# Altium schematic sheet 1_P1.schdoc
size 314 x 314 mm; Symbol: Drawing-Symbol_A4; Device: Drawing-Symbol_A4; @Project Name: AudioDeck; @Page Count: 1; @Update Date: 2026-05-18; @Create Date: 2026-05-18; @Schematic Name: Schematic 1.3; @Page No: 1; @Page Name: P1; Company: EasyEDA.com; Version: V1.0; Page Size: A4; @Create Time: 18:39:17; @Update Time: 13:41:27; Width: 1200; Height: 1200; Region Start: 1; X Region Count: 6; Y Region Count: 4; Blade Width: 10; Title Block Position: 3; @Board Name: Prototype 1.3
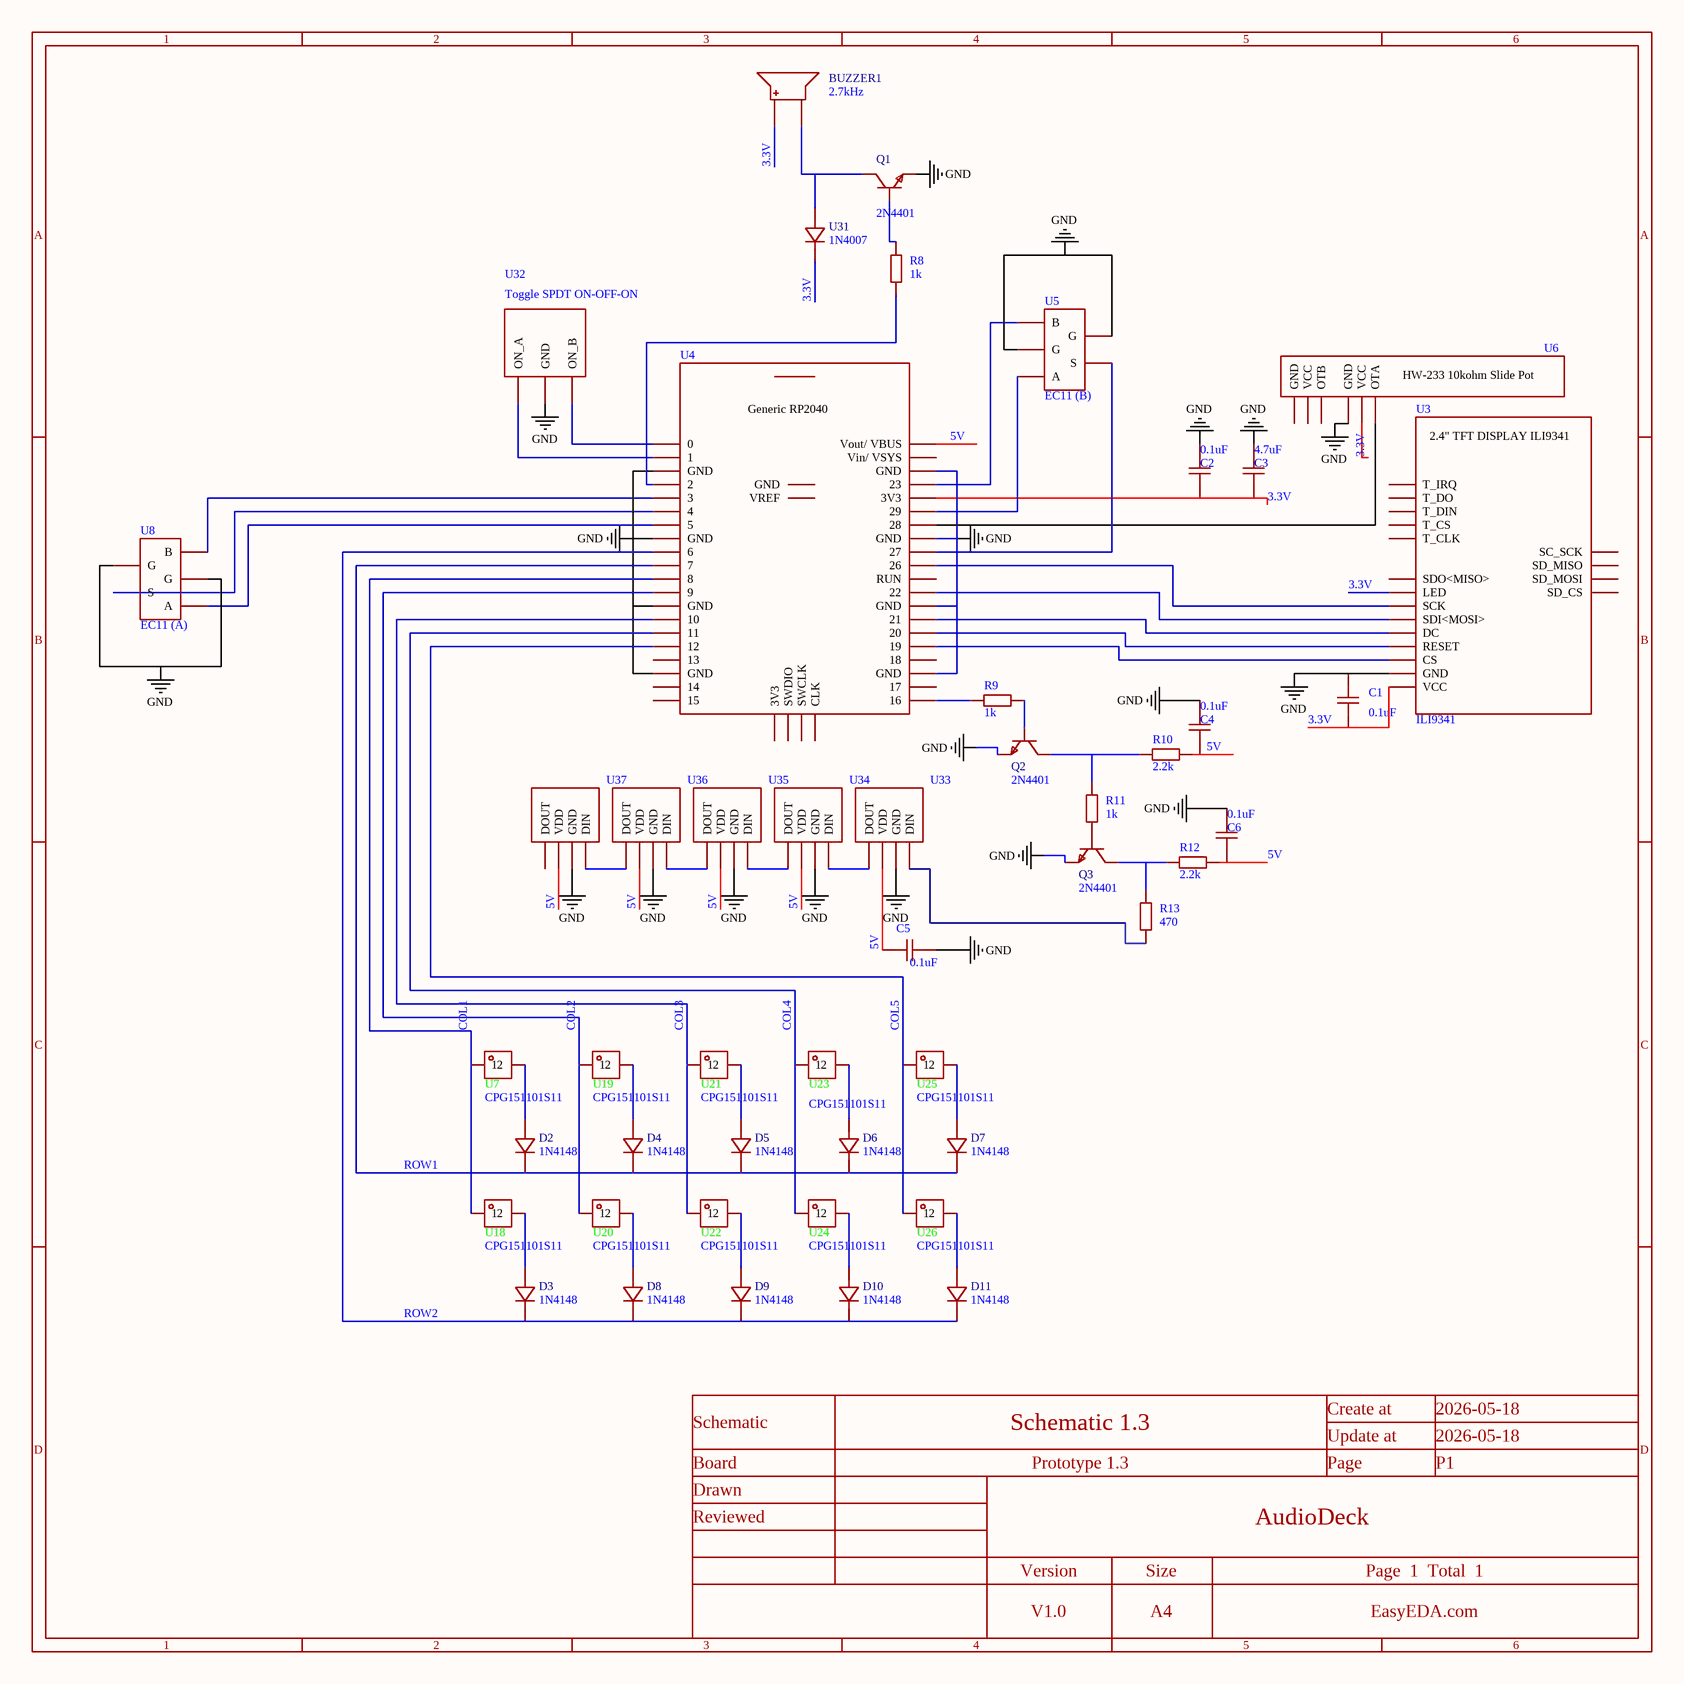
[diagram p0: 1_P1.schdoc]

## Parts
BUZZER1  2.7kHz  [BUZ-TH_BD9.0-P4.00-D0.6-FD]
C1  0.1uF  [C0603]
C2  0.1uF  [C0603]
C3  4.7uF  [C0603]
C4  0.1uF  [C0603]
C5  0.1uF  [C0603]
C6  0.1uF  [C0603]
D2  1N4148  [DO-35_BD1.7-L3.6-P10.00-D0.5-RD]
D3  1N4148  [DO-35_BD1.7-L3.6-P10.00-D0.5-RD]
D4  1N4148  [DO-35_BD1.7-L3.6-P10.00-D0.5-RD]
D5  1N4148  [DO-35_BD1.7-L3.6-P10.00-D0.5-RD]
D6  1N4148  [DO-35_BD1.7-L3.6-P10.00-D0.5-RD]
D7  1N4148  [DO-35_BD1.7-L3.6-P10.00-D0.5-RD]
D8  1N4148  [DO-35_BD1.7-L3.6-P10.00-D0.5-RD]
D9  1N4148  [DO-35_BD1.7-L3.6-P10.00-D0.5-RD]
D10  1N4148  [DO-35_BD1.7-L3.6-P10.00-D0.5-RD]
D11  1N4148  [DO-35_BD1.7-L3.6-P10.00-D0.5-RD]
Q1  2N4401  [TO-92-3_L4.9-W3.7-P1.27-L]
Q2  2N4401  [TO-92-3_L4.9-W3.7-P1.27-L]
Q3  2N4401  [TO-92-3_L4.9-W3.7-P1.27-L]
R8  1k  [R0603]
R9  1k  [R0603]
R10  2.2k  [R0603]
R11  1k  [R0603]
R12  2.2k  [R0603]
R13  470  [R0603]
U3  ILI9341
U4  (no value)
U5  EC11 (B)
U6  (no value)
U7  CPG151101S11  [TH_L11.0-W5.9-KS-2P02B01-01]
U8  EC11 (A)
U18  CPG151101S11  [TH_L11.0-W5.9-KS-2P02B01-01]
U19  CPG151101S11  [TH_L11.0-W5.9-KS-2P02B01-01]
U20  CPG151101S11  [TH_L11.0-W5.9-KS-2P02B01-01]
U21  CPG151101S11  [TH_L11.0-W5.9-KS-2P02B01-01]
U22  CPG151101S11  [TH_L11.0-W5.9-KS-2P02B01-01]
U23  CPG151101S11  [TH_L11.0-W5.9-KS-2P02B01-01]
U24  CPG151101S11  [TH_L11.0-W5.9-KS-2P02B01-01]
U25  CPG151101S11  [TH_L11.0-W5.9-KS-2P02B01-01]
U26  CPG151101S11  [TH_L11.0-W5.9-KS-2P02B01-01]
U31  1N4007  [DO-41_BD2.4-L4.7-P8.70-D0.6-RD]
U32  Toggle SPDT ON-OFF-ON
U33  (no value)
U34  (no value)
U35  (no value)
U36  (no value)
U37  (no value)

## Nets
GND: C1.1 C2.1 C3.1 C4.1 C5.2 C6.1 Q1.1(E) Q2.1(E) Q3.1(E) U3.2(GND) U4.3(GND) U4.8(GND) U4.13(GND) U4.18(GND) U4.23(GND) U4.28(GND) U4.33(GND) U4.38(GND) U5.1(G) U5.4(G) U6.4(GND) U8.1(G) U8.4(G) U32.2(GND) U33.3(GND) U34.3(GND) U35.3(GND) U36.3(GND) U37.3(GND)
3.3V: BUZZER1.1 C1.2 C2.2 C3.2 U3.1(VCC) U3.8(LED) U4.25(3V3) U6.5(VCC) U31.1(C)
5V: C4.2 C5.1 C6.2 R10.1 R12.1 U4.21(Vout/_VBUS) U33.2(VDD) U34.2(VDD) U35.2(VDD) U36.2(VDD) U37.2(VDD)
COL1: U4.11(8) U7.1 U18.1
COL2: U4.12(9) U19.1 U20.1
COL3: U4.14(10) U21.1 U22.1
COL4: U4.15(11) U23.1 U24.1
COL5: U4.16(12) U25.1 U26.1
ROW1: D2.1(C) D4.1(C) D5.1(C) D6.1(C) D7.1(C) U4.10(7)
ROW2: D3.1(C) D8.1(C) D9.1(C) D10.1(C) D11.1(C) U4.9(6)
NetBUZZER1_2: BUZZER1.2 Q1.3(C) U31.2(A)
NetD2_2: D2.2(A) U7.2
NetD3_2: D3.2(A) U18.2
NetD4_2: D4.2(A) U19.2
NetD5_2: D5.2(A) U21.2
NetD6_2: D6.2(A) U23.2
NetD7_2: D7.2(A) U25.2
NetD8_2: D8.2(A) U20.2
NetD9_2: D9.2(A) U22.2
NetD10_2: D10.2(A) U24.2
NetD11_2: D11.2(A) U26.2
NetQ1_2: Q1.2(B) R8.2
NetQ2_2: Q2.2(B) R9.1
NetQ2_3: Q2.3(C) R10.2 R11.1
NetQ3_2: Q3.2(B) R11.2
NetQ3_3: Q3.3(C) R12.2 R13.1
NetR8_1: R8.1 U4.4(2)
NetR9_2: R9.2 U4.40(16)
NetR13_2: R13.2 U33.4(DIN)
NetU3_3: U3.3(CS) U4.36(19)
NetU3_4: U3.4(RESET) U4.35(20)
NetU3_5: U3.5(DC) U4.34(21)
NetU3_6: U3.6(SDI<MOSI>) U4.32(22)
NetU3_7: U3.7(SCK) U4.30(26)
NetU4_1: U4.1(0) U32.3(ON_B)
NetU4_2: U4.2(1) U32.1(ON_A)
NetU4_5: U4.5(3) U8.5(B)
NetU4_6: U4.6(4) U8.2(S)
NetU4_7: U4.7(5) U8.3(A)
NetU4_24: U4.24(23) U5.5(B)
NetU4_26: U4.26(29) U5.3(A)
NetU4_27: U4.27(28) U6.6(OTA)
NetU4_29: U4.29(27) U5.2(S)
NetU33_1: U33.1(DOUT) U34.4(DIN)
NetU34_1: U34.1(DOUT) U35.4(DIN)
NetU35_1: U35.1(DOUT) U36.4(DIN)
NetU36_1: U36.1(DOUT) U37.4(DIN)

Not connected (* = marked no-connect by the designer): U3 9(SDO<MISO>) 10(T_CLK) 11(T_CS) 12(T_DIN) 13(T_DO) 14(T_IRQ) 15(SD_CS) 16(SD_MOSI) 17(SD_MISO) 18(SC_SCK); U4 17(13) 19(14) 20(15) 22(Vin/_VSYS) 31(RUN) 37(18) 39(17) 41(GND) 42(VREF) 43(3V3) 44(SWDIO) 45(SWCLK) 46(CLK); U6 1(GND) 2(VCC) 3(OTB); U37 1(DOUT)

## Notes on the sheet
- 1
- 2
- 3
- 4
- 5
- 6
- A
- B
- C
- Schematic
- Schematic 1.3
- Create at
- Update at
- 2026-05-18
- D
- Board
- Drawn
- Prototype 1.3
- Page
- P1
- Reviewed
- Version
- Size
- AudioDeck
- Page  1  Total  1
- V1.0
- A4
- EasyEDA.com
- (in symbol HW-233 10k Slide Pot) HW-233 10kohm Slide Pot
- (in symbol ILI9341) 2.4" TFT DISPLAY ILI9341
- (in symbol RP2040-GENERIC-ALEXP) Generic RP2040

## Library data of the parts
BUZZER1 = QMB-09B-03: Manufacturer: 华能; Add into BOM: yes; Driver Circuitry: Passive (Externally Driven); Voltage - Supply: 2V~5V; Sound Pressure Level(SPL): 85dB; Symbol: QMB-09B-03; Device: QMB-09B-03; LCSC Part Name: 无源蜂鸣器QMB-09B-03; Supplier Part: C96256; Manufacturer Part: QMB-09B-03; Supplier Footprint: 插件,D=9mm; JLCPCB Part Class: Extended Part; Datasheet: https://item.szlcsc.com/datasheet/QMB-09B-03/97460.html; Supplier: LCSC; Convert to PCB: yes; Technology: Electromagnetic; Value: 2.7kHz; Diameter(φD): 9mm; Height: 5.7mm
C1-C6 = CAP_0603: Symbol: CAP; Convert to PCB: yes; Device: CAP_0603; Add into BOM: yes; Supplier Footprint: 0603
  C1 C2 C4-C6: Value: 0.1uF
  C3: Value: 4.7uF
D2-D11 = 1N4148_C22434654: Manufacturer: DIOTEC(德欧泰克); Add into BOM: yes; Pd - Power Dissipation: 500mW; Current - Rectified: 200mA; Voltage - DC Reverse(Vr): 75V; Voltage - Forward(Vf@If): 1V@10mA; Reverse Leakage Current (Ir): 5uA@75V; Operating Junction Temperature Range: -50℃~+175℃; Symbol: 1N4148_C22434654; Device: 1N4148_C22434654; LCSC Part Name: 1N4148; Supplier Part: C22434654; Manufacturer Part: 1N4148; Supplier Footprint: DO-35; JLCPCB Part Class: Extended Part; Datasheet: https://item.szlcsc.com/datasheet/1N4148/24058303.html; Supplier: LCSC; Convert to PCB: yes; Diode Configuration: -; Non-Repetitive Peak Forward Surge Current: -; Reverse Recovery Time (trr): -
Q1-Q3 = 2N4401: Manufacturer: ST(先科); Add into BOM: yes; type: NPN; Collector - Emitter Voltage VCEO: 40V; Pd - Power Dissipation: 625mW; DC Current Gain: 100@150mA,1V; Transition frequency(fT): 250MHz; Current - Collector Cutoff: 100nA; Vce Saturation(VCE(sat)): 750mV; Symbol: 2N4401; Device: 2N4401; LCSC Part Name: hfe=40~300; Supplier Part: C118540; Manufacturer Part: 2N4401; Supplier Footprint: TO-92-3; JLCPCB Part Class: Extended Part; Datasheet: https://atta.szlcsc.com/upload/public/pdf/source/20170719/C118540_1500457735787828248.pdf; Supplier: LCSC; Convert to PCB: yes; Operating Temperature: -
R8-R13 = Res_0603: Symbol: Res; Convert to PCB: yes; Device: Res_0603; Add into BOM: yes; Supplier Footprint: 0603
  R8 R9 R11: Value: 1k
  R10 R12: Value: 2.2k
  R13: Value: 470
U3 = ILI9341: Add into BOM: yes; Symbol: ILI9341; Device: ILI9341; Convert to PCB: yes
U4 = RP2040-GENERIC-ALEXP: Add into BOM: yes; Symbol: RP2040-GENERIC-ALEXP; Device: RP2040-GENERIC-ALEXP; Convert to PCB: yes
U5 U8 = Generic EC11 encoder: Add into BOM: yes; Symbol: Generic EC11 encoder; Device: Generic EC11 encoder; Convert to PCB: yes
U6 = HW-233 10k Slide Pot: Add into BOM: yes; Symbol: HW-233 10k Slide Pot; Device: HW-233 10k Slide Pot; Convert to PCB: yes
U7 U18-U26 = CPG151101S11: Add into BOM: yes; Symbol: CPG151101S11; Device: CPG151101S11; LCSC Part Name: CPG151101S11; Supplier Part: C9900013508; Manufacturer Part: CPG151101S11; Supplier Footprint: CherryMX_KailhSocket:MXOnly-1U-Hotswap; JLCPCB Part Class: Extended Part; Supplier: LCSC; Convert to PCB: yes
U31 = 1N4007_C5261026: Manufacturer: CJ(江苏长电/长晶); Add into BOM: yes; Voltage - Forward(Vf@If): 1.1V@1A; Voltage - DC Reverse(Vr): 1kV; Current - Rectified: 1A; Reverse Leakage Current (Ir): 5uA@1000V; Non-Repetitive Peak Forward Surge Current: 30A; Operating Junction Temperature Range: -55℃~+150℃; Symbol: 1N4007_C5261026; Device: 1N4007_C5261026; LCSC Part Name: 1kV 1A; Supplier Part: C5261026; Manufacturer Part: 1N4007; Supplier Footprint: DO-41; JLCPCB Part Class: Extended Part; Datasheet: https://item.szlcsc.com/datasheet/1N4007/5983537.html; Supplier: LCSC; Convert to PCB: yes
U32 = SPDT Toggle ON-OFF-ON (3pin): Add into BOM: yes; Symbol: SPDT Toggle ON-OFF-ON (3pin); Device: SPDT Toggle ON-OFF-ON (3pin); Convert to PCB: yes
U33-U37 = 5mm WS2812B ARGB LED TH: Add into BOM: yes; Symbol: 5mm WS2812B ARGB LED TH; Device: 5mm WS2812B ARGB LED TH; Convert to PCB: yes